# EAGLE design M1713X (EAGLE 6.6.0)
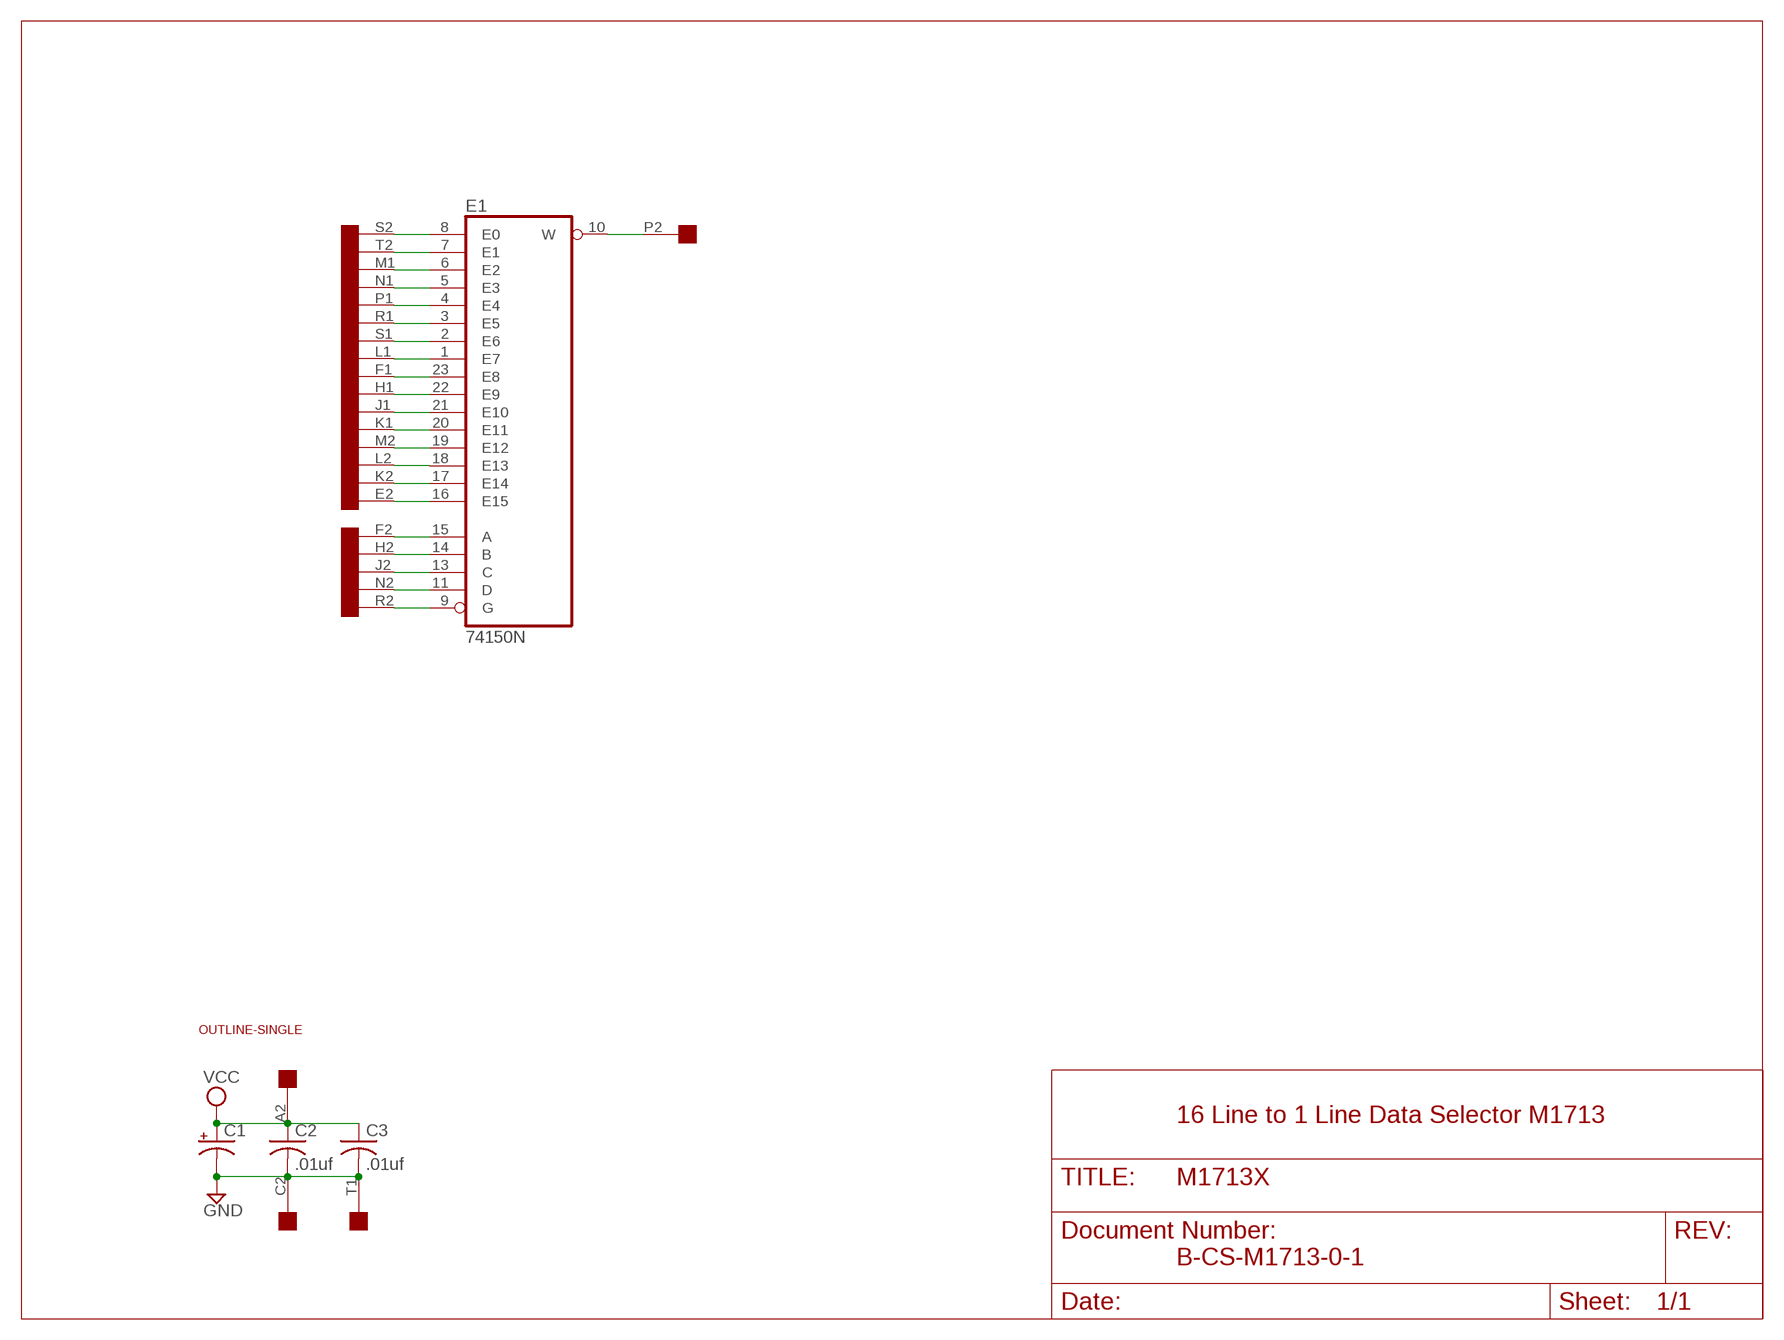
[diagram p0: schematic, sheet 1]

## Parts
C1  CPOL-USE22-6AXIAL  [E22-6]
C2  .01uf  C-US050-025X075  [C050-025X075]
C3  .01uf  C-US050-025X075  [C050-025X075]
E1  74150N  [DIL24-6]
U$1  OUTLINE-SINGLE  [SINGLE]
U$2  EDGE-2CONNECTOR  [EDGE-CON2]

## Nets
GND [Supply]: C1.- C2.2 C3.2 U$2.C2 U$2.T1
N$1: E1.8(E0) U$2.S2
N$2: E1.6(E2) U$2.M1
N$3: E1.5(E3) U$2.N1
N$4: E1.4(E4) U$2.P1
N$5: E1.3(E5) U$2.R1
N$6: E1.2(E6) U$2.S1
N$7: E1.10(W) U$2.P2
N$8: E1.23(E8) U$2.F1
N$9: E1.1(E7) U$2.L1
N$10: E1.22(E9) U$2.H1
N$11: E1.20(E11) U$2.K1
N$12: E1.21(E10) U$2.J1
N$13: E1.19(E12) U$2.M2
N$14: E1.7(E1) U$2.T2
N$15: E1.18(E13) U$2.L2
N$16: E1.17(E14) U$2.K2
N$17: E1.16(E15) U$2.E2
N$18: E1.15(A) U$2.F2
N$19: E1.14(B) U$2.H2
N$20: E1.13(C) U$2.J2
N$21: E1.11(D) U$2.N2
N$22: E1.9(G) U$2.R2
VCC [Supply]: C1.+ C2.1 C3.1 U$2.A2
Unconnected: U$2.A1 U$2.B1 U$2.B2 U$2.C1 U$2.D1 U$2.D2 U$2.E1 U$2.U1 U$2.U2 U$2.V1 U$2.V2

## Notes on the sheet
- 16 Line to 1 Line Data Selector M1713
- B-CS-M1713-0-1

## Power pins joined to a net without a drawn wire
GND: E1.12(GND)
VCC: E1.24(VCC)

## Library data of the parts
C1 = rcl:CPOL-US: POLARIZED CAPACITOR, American symbol
C2 C3 = rcl:C-US: CAPACITOR, American symbol
E1 = 74xx-us:74*150: Data SELCTOR/MULTIPLEXER
U$1 = dec-con:OUTLINE-*: Board outlines for DEC boards.
U$2 = dec-con:EDGE-2: Double-Sided DEC edge connector.

## Net classes
1 Supply: width 0.813 mm

## Board
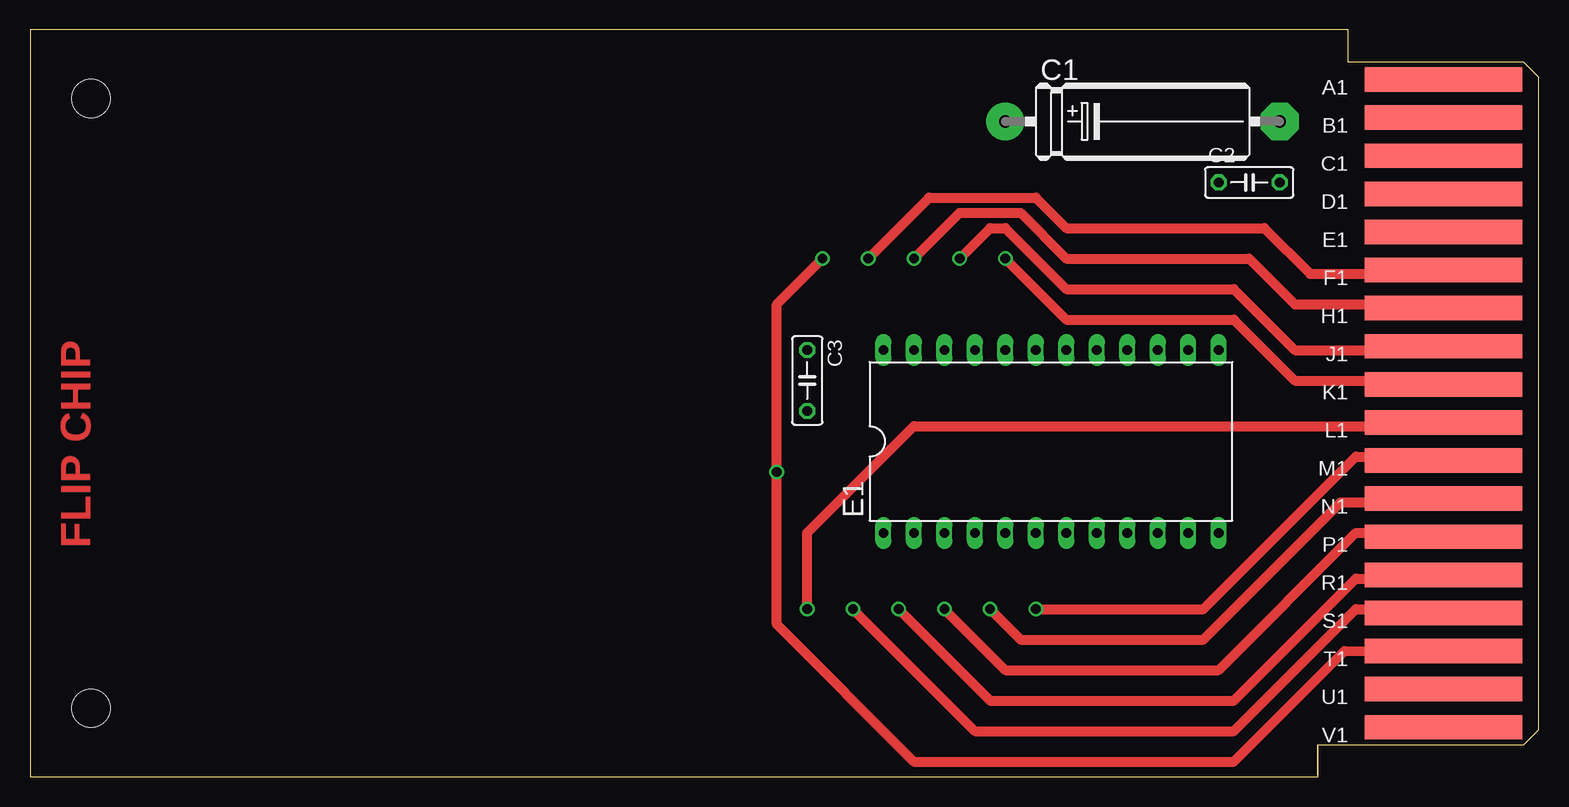
[diagram p1: board, top side]
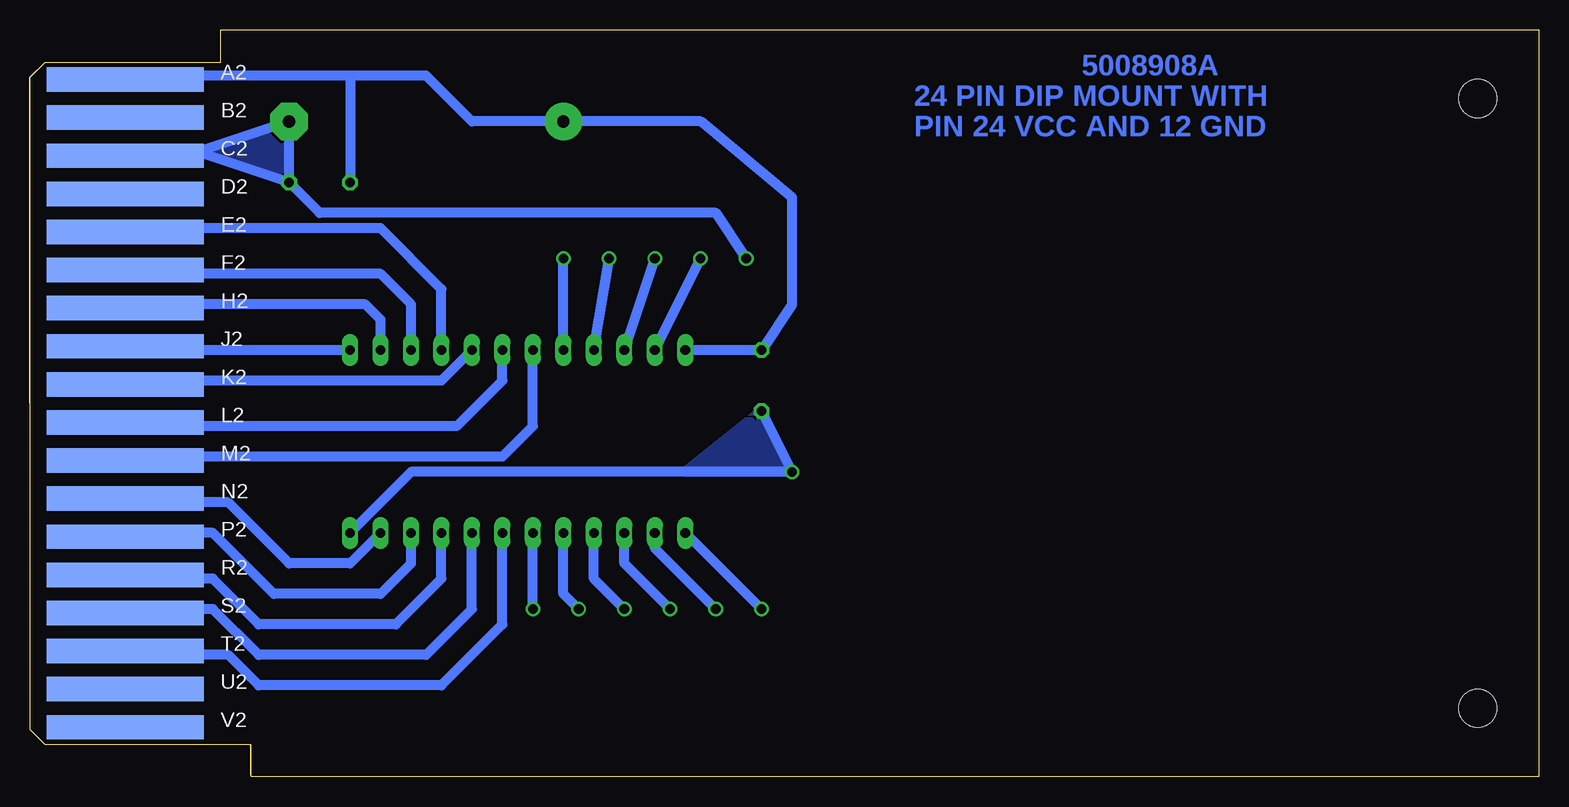
[diagram p2: board, bottom side, seen from below]

Size 125.73 x 62.23 mm. Coordinates in mm from the lower left corner, seen from the top.
Copper layers (1+16): Top 0.035mm / dielectric 1.5mm / Bottom 0.035mm
Design rules "16mils": minimum track width 16mil, minimum drill 32mil, track to track 15mil, track to pad 10mil, pad to pad 10mil, via to via 10mil, smd to smd 10mil, copper to edge 25mil, drill to drill 10mil, minimum pad ring 10mil, minimum via ring 8mil, stop-mask expansion 0mil, vias tented up to drill 0mil, thermal gap 10mil

### Footprints (pad centres in the part's own frame; a part is rotated, then mirrored left to right if it is on the bottom)
E22-6 = drill 1.016 pad 3.15: + -11.43,0 | drill 1.016 pad 3.15 octagon: - 11.43,0
C050-025X075 = drill 0.813 octagon: 1 -2.54,0; 2 2.54,0
DIL24-6 = drill 0.813 long: 1 -13.97,-7.62; 2 -11.43,-7.62; 3 -8.89,-7.62; 4 -6.35,-7.62; 5 -3.81,-7.62; 6 -1.27,-7.62; 7 1.27,-7.62; 8 3.81,-7.62; 9 6.35,-7.62; 10 8.89,-7.62; 11 11.43,-7.62; 12 13.97,-7.62; 13 13.97,7.62; 14 11.43,7.62; 15 8.89,7.62; 16 6.35,7.62; 17 3.81,7.62; 18 1.27,7.62; 19 -1.27,7.62; 20 -3.81,7.62; 21 -6.35,7.62; 22 -8.89,7.62; 23 -11.43,7.62; 24 -13.97,7.62
SINGLE = hole 3.175: 120.65,56.515; 120.65,5.715
EDGE-CON2 = smd 13.106 x 2.032: A1 7.938,4.128; B1 7.938,7.303; C1 7.938,10.477; D1 7.938,13.652; E1 7.938,16.828; F1 7.938,20.003; H1 7.938,23.177; J1 7.938,26.352; K1 7.938,29.527; L1 7.938,32.703; M1 7.938,35.877; N1 7.938,39.053; P1 7.938,42.227; R1 7.938,45.403; S1 7.938,48.578; T1 7.938,51.752; U1 7.938,54.928; V1 7.938,58.102 | smd 13.106 x 2.032 bottom: A2 7.938,4.128; B2 7.938,7.303; C2 7.938,10.477; D2 7.938,13.652; E2 7.938,16.828; F2 7.938,20.003; H2 7.938,23.177; J2 7.938,26.352; K2 7.938,29.527; L2 7.938,32.703; M2 7.938,35.877; N2 7.938,39.053; P2 7.938,42.227; R2 7.938,45.403; S2 7.938,48.578; T2 7.938,51.752; U2 7.938,54.928; V2 7.938,58.102

### Placement (x,y rotation side)
C1  92.71,54.61 0 top
C2  101.6,49.53 0 top
C3  64.77,33.02 270 top
E1  85.09,27.94 0 top
U$1  125.73,62.23 180 top
U$2  125.73,62.23 180 top
U$3  [FLIPCHIP]  0,0 0 top

### Tracks (layer width: path | path; a pad name or v marks a point on that pad's centre or on a via)
GND  (via drill 0.81)
  Top 0.813: U$2.T1 109.55,10.49 100.33,1.27 73.66,1.27 62.23,12.7 v62.23,25.4 62.23,39.37 v66.04,43.18
  Bottom 0.813: C2.2 C1.- 111.76,52.07 | U$2.C2 117.17,51.74 116.84,52.07 111.76,52.07 | C2.2 111.76,52.07 | C2.2 101.6,46.99 68.58,46.99 v66.04,43.18 | E1.12 93.98,25.4 v62.23,25.4 C3.2
  pour Bottom: 104.14,54.61 111.76,52.07 104.14,49.53
  pour Bottom: 62.23,25.4 64.77,30.48 71.12,25.4
N$1
  Bottom 0.813: U$2.S2 117.14,13.66 116.84,13.97 110.49,13.97 106.68,10.16 92.71,10.16 88.9,13.97 E1.8
N$2  (via drill 0.81)
  Top 0.813: U$2.M1 117.17,26.34 116.84,26.67 110.49,26.67 97.79,13.97 v83.82,13.97
  Bottom 0.813: v83.82,13.97 E1.6
N$3  (via drill 0.81)
  Top 0.813: U$2.N1 117.17,23.19 116.84,22.86 109.22,22.86 97.79,11.43 82.55,11.43 v80.01,13.97
  Bottom 0.813: E1.5 81.28,15.24 v80.01,13.97
N$4  (via drill 0.81)
  Top 0.813: U$2.P1 117.17,19.99 116.84,20.32 110.49,20.32 99.06,8.89 81.28,8.89 v76.2,13.97
  Bottom 0.813: E1.4 78.74,16.51 v76.2,13.97
N$5  (via drill 0.81)
  Top 0.813: U$2.R1 117.17,16.84 116.84,16.51 110.49,16.51 100.33,6.35 80.01,6.35 v72.39,13.97
  Bottom 0.813: E1.3 76.2,17.78 v72.39,13.97
N$6  (via drill 0.81)
  Top 0.813: U$2.S1 117.14,13.66 116.84,13.97 110.49,13.97 100.33,3.81 78.74,3.81 v68.58,13.97
  Bottom 0.813: E1.2 73.66,19.05 v68.58,13.97
N$7
  Bottom 0.813: U$2.P2 117.17,19.99 116.84,20.32 110.49,20.32 105.41,15.24 96.52,15.24 93.98,17.78 E1.10
N$8  (via drill 0.81)
  Top 0.813: U$2.F1 115.85,42.19 115.57,41.91 106.68,41.91 102.87,45.72 86.36,45.72 83.82,48.26 74.93,48.26 v69.85,43.18
  Bottom 0.813: E1.23 v69.85,43.18
N$9  (via drill 0.81)
  Top 0.813: U$2.L1 117.17,29.54 116.84,29.21 73.66,29.21 64.77,20.32 v64.77,13.97
  Bottom 0.813: v64.77,13.97 E1.1
N$10  (via drill 0.81)
  Top 0.813: U$2.H1 115.9,39.04 115.57,39.37 105.41,39.37 101.6,43.18 86.36,43.18 82.55,46.99 77.47,46.99 v73.66,43.18
  Bottom 0.813: E1.22 v73.66,43.18
N$11  (via drill 0.81)
  Top 0.813: U$2.K1 117.14,32.72 116.84,33.02 105.41,33.02 100.33,38.1 86.36,38.1 v81.28,43.18
  Bottom 0.813: E1.20 v81.28,43.18
N$12  (via drill 0.81)
  Top 0.813: U$2.J1 117.17,35.89 116.84,35.56 105.41,35.56 100.33,40.64 86.36,40.64 81.28,45.72 80.01,45.72 v77.47,43.18
  Bottom 0.813: E1.21 v77.47,43.18
N$13
  Bottom 0.813: U$2.M2 117.76,26.67 86.36,26.67 83.82,29.21 E1.19
N$14
  Bottom 0.813: U$2.T2 117.17,10.49 116.84,10.16 109.22,10.16 106.68,7.62 91.44,7.62 86.36,12.7 E1.7
N$15
  Bottom 0.813: U$2.L2 117.76,29.21 90.17,29.21 86.36,33.02 E1.18
N$16
  Bottom 0.813: U$2.K2 117.78,33.02 91.44,33.02 E1.17
N$17
  Bottom 0.813: U$2.E2 117.17,45.39 116.84,45.72 96.52,45.72 91.44,40.64 E1.16
N$18
  Bottom 0.813: U$2.F2 115.85,42.19 115.57,41.91 96.52,41.91 93.98,39.37 E1.15
N$19
  Bottom 0.813: U$2.H2 117.78,39.37 97.79,39.37 96.52,38.1 E1.14
N$20
  Bottom 0.813: U$2.J2 117.17,35.89 116.84,35.56 E1.13
N$21
  Bottom 0.813: E1.11 99.06,17.78 104.14,17.78 109.22,22.86 116.84,22.86 117.17,23.19 U$2.N2
N$22
  Bottom 0.813: U$2.R2 117.17,16.84 116.84,16.51 110.49,16.51 106.68,12.7 95.25,12.7 91.44,16.51 E1.9
VCC
  Bottom 0.813: U$2.A2 117.24,58.02 116.84,58.42 99.06,58.42 | 99.06,58.42 92.71,58.42 88.9,54.61 C1.+ 69.85,54.61 62.23,48.26 62.23,39.37 C3.1 E1.24 | 99.06,58.42 C2.1

### Text on the board
Bottom: 5008908A | 24 PIN DIP MOUNT WITH | PIN 24 VCC AND 12 GND